# EAGLE design emonPi_v2.0.1 (EAGLE 9.6.2)
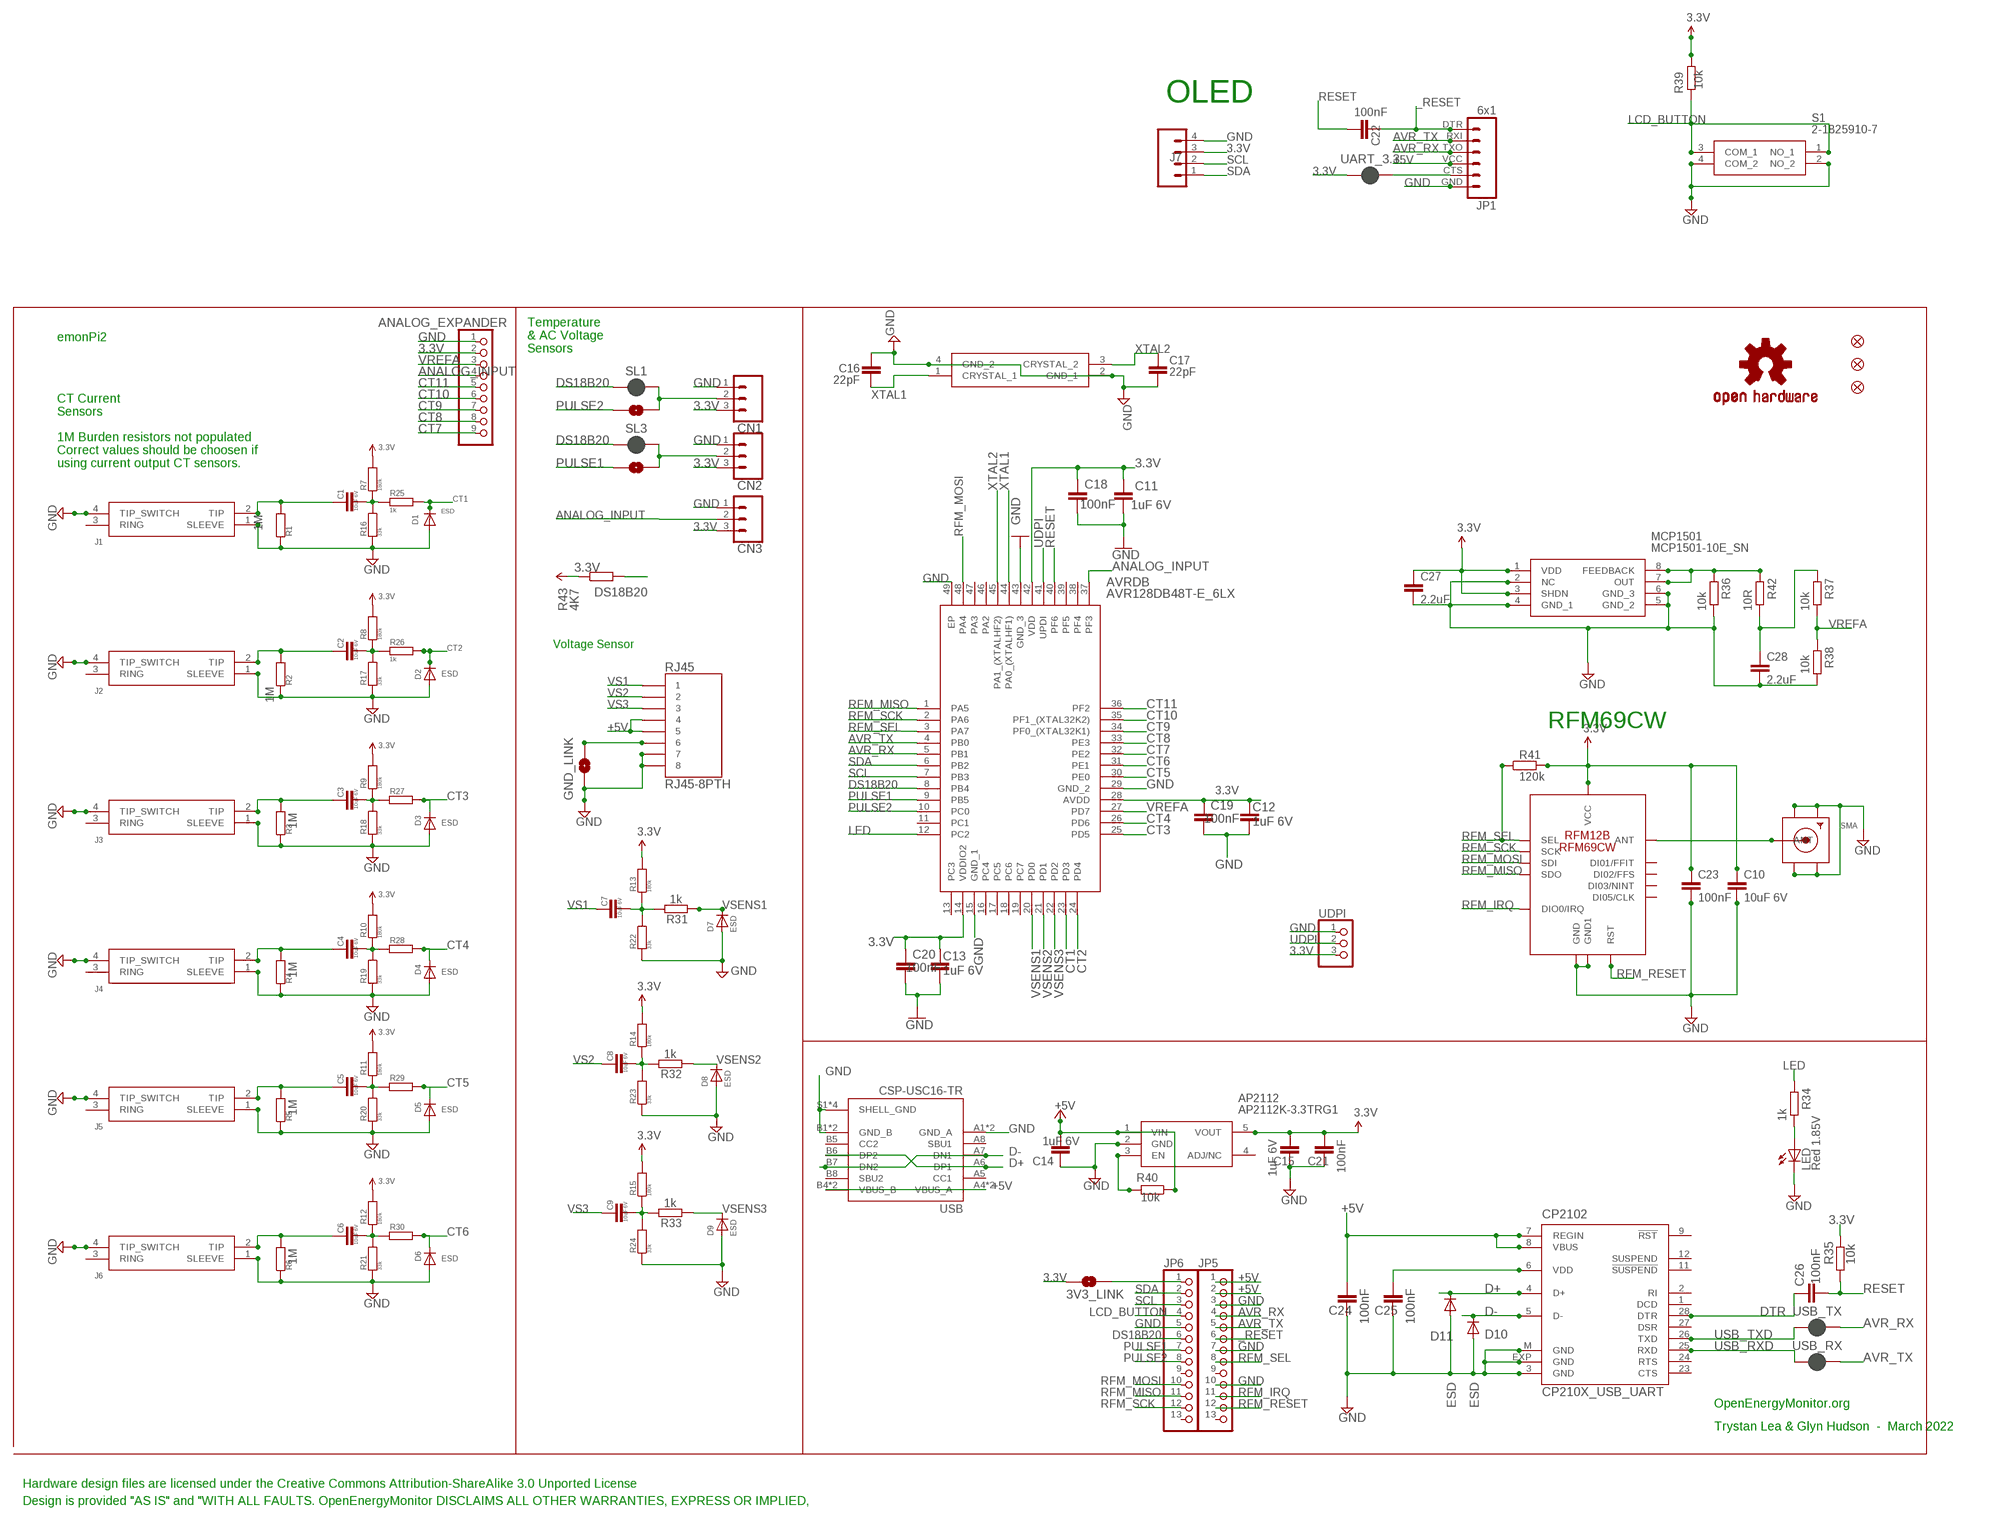
[diagram p0: schematic, sheet 1]

## Parts
3V3_LINK  SOLDERJUMPERNC  [SJ_2S]
ANALOG_EXPANDER  PINHD-1X9  [1X09-BIG]
AP2112  AP2112K-3.3TRG1  [SOT95P282X130-5N]
AVRDB  AVR128DB48T-E_6LX  [QFN40P600X600X90-49N]
C1  10uF 6V  C-EUC0603  [C0603]
C2  10uF 6V  C-EUC0603  [C0603]
C3  10uF 6V  C-EUC0603  [C0603]
C4  10uF 6V  C-EUC0603  [C0603]
C5  10uF 6V  C-EUC0603  [C0603]
C6  10uF 6V  C-EUC0603  [C0603]
C7  10uF 6V  C-EUC0603  [C0603]
C8  10uF 6V  C-EUC0603  [C0603]
C9  10uF 6V  C-EUC0603  [C0603]
C10  10uF 6V  C-EUC0603  [C0603]
C11  1uF 6V  C-EUC0603  [C0603]
C12  1uF 6V  C-EUC0603  [C0603]
C13  1uF 6V  C-EUC0603  [C0603]
C14  1uF 6V  C-EUC0603  [C0603]
C15  1uF 6V  C-EUC0603  [C0603]
C16  22pF  C-EUC0603  [C0603]
C17  22pF  C-EUC0603  [C0603]
C18  100nF  C-EUC0603  [C0603]
C19  100nF  C-EUC0603  [C0603]
C20  100nF  C-EUC0603  [C0603]
C21  100nF  C-EUC0603  [C0603]
C22  100nF  C-EUC0603  [C0603]
C23  100nF  C-EUC0603  [C0603]
C24  100nF  C-EUC0603  [C0603]
C25  100nF  C-EUC0603  [C0603]
C26  100nF  C-EUC0603  [C0603]
C27  2.2uF  C-EUC0603  [C0603]
C28  2.2uF  C-EUC0603  [C0603]
CN1  CONN_03SCREW  [SCREWTERMINAL-3.5MM-3]
CN2  CONN_03SCREW  [SCREWTERMINAL-3.5MM-3]
CN3  CONN_03SCREW  [SCREWTERMINAL-3.5MM-3]
CP2102  CP210X_USB_UART  [MLP28]
D1  ESD  DIODESOD-523  [SOD-523]
D2  ESD  DIODESOD-523  [SOD-523]
D3  ESD  DIODESOD-523  [SOD-523]
D4  ESD  DIODESOD-523  [SOD-523]
D5  ESD  DIODESOD-523  [SOD-523]
D6  ESD  DIODESOD-523  [SOD-523]
D7  ESD  DIODESOD-523  [SOD-523]
D8  ESD  DIODESOD-523  [SOD-523]
D9  ESD  DIODESOD-523  [SOD-523]
D10  ESD  DIODESOD-523  [SOD-523]
D11  ESD  DIODESOD-523  [SOD-523]
FD1  FIDUCIAL1X2  [FIDUCIAL-1X2]
FD2  FIDUCIAL1X2  [FIDUCIAL-1X2]
FD3  FIDUCIAL1X2  [FIDUCIAL-1X2]
GND_LINK  SOLDERJUMPERNC  [SJ_2S]
J1  SJ-3524-SMT-TR  [SJ-3524-SMT-TR]
J2  SJ-3524-SMT-TR  [SJ-3524-SMT-TR]
J3  SJ-3524-SMT-TR  [SJ-3524-SMT-TR]
J4  SJ-3524-SMT-TR  [SJ-3524-SMT-TR]
J5  SJ-3524-SMT-TR  [SJ-3524-SMT-TR]
J6  SJ-3524-SMT-TR  [SJ-3524-SMT-TR]
J7  CONN_04PTH  [1X04]
JP1  6x1  FTDI_BASICPTH  [FTDI_BASIC]
JP5  PINHD-1X13_BIG  [1X13-BIG]
JP6  PINHD-1X13_BIG  [1X13-BIG]
LED  Red 1.85V  LEDCHIP-LED0805  [CHIP-LED0805]
LOGO1  OSHW-LOGOS-COPPER  [OSHW-LOGO-S_COPPER]
MCP1501  MCP1501-10E_SN  [SOIC127P600X175-8N]
R1  1M  R-EU_R1206  [R1206]
R2  1M  R-EU_R1206  [R1206]
R3  1M  R-EU_R1206  [R1206]
R4  1M  R-EU_R1206  [R1206]
R5  1M  R-EU_R1206  [R1206]
R6  1M  R-EU_R1206  [R1206]
R7  180k  R-EU_R0603  [R0603]
R8  180k  R-EU_R0603  [R0603]
R9  180k  R-EU_R0603  [R0603]
R10  180k  R-EU_R0603  [R0603]
R11  180k  R-EU_R0603  [R0603]
R12  180k  R-EU_R0603  [R0603]
R13  180k  R-EU_R0603  [R0603]
R14  180k  R-EU_R0603  [R0603]
R15  180k  R-EU_R0603  [R0603]
R16  33k  R-EU_R0603  [R0603]
R17  33k  R-EU_R0603  [R0603]
R18  33k  R-EU_R0603  [R0603]
R19  33k  R-EU_R0603  [R0603]
R20  33k  R-EU_R0603  [R0603]
R21  33k  R-EU_R0603  [R0603]
R22  33k  R-EU_R0603  [R0603]
R23  33k  R-EU_R0603  [R0603]
R24  33k  R-EU_R0603  [R0603]
R25  1k  R-EU_R0603  [R0603]
R26  1k  R-EU_R0603  [R0603]
R27  1k  R-EU_R0603  [R0603]
R28  1k  R-EU_R0603  [R0603]
R29  1k  R-EU_R0603  [R0603]
R30  1k  R-EU_R0603  [R0603]
R31  1k  R-EU_R0603  [R0603]
R32  1k  R-EU_R0603  [R0603]
R33  1k  R-EU_R0603  [R0603]
R34  1k  R-EU_R0603  [R0603]
R35  10k  R-EU_R0603  [R0603]
R36  10k  R-EU_R0603  [R0603]
R37  10k  R-EU_R0603  [R0603]
R38  10k  R-EU_R0603  [R0603]
R39  10k  R-EU_R0603  [R0603]
R40  10k  R-EU_R0603  [R0603]
R41  120k  R-EU_R0603  [R0603]
R42  10R  R-EU_R0603  [R0603]
R43  4K7  R-EU_R0603  [R0603]
RFM69  RFM12B/69CW  [RFM12B/69CW]
RJ45  RJ45-8PTH  [RJ45-8]
S1  2-1825910-7  [218259107]
SL1  JUMPER-SMT_2_NC_PASTE_NO-SILK  [SMT-JUMPER_2_NC_PASTE_NO-SILK]
SL2  SOLDERJUMPERNC  [SJ_2S]
SL3  JUMPER-SMT_2_NC_PASTE_NO-SILK  [SMT-JUMPER_2_NC_PASTE_NO-SILK]
SL4  SOLDERJUMPERNC  [SJ_2S]
SMA  SMACONNECTOR  [SMA90_DIP]
UART_3.3  JUMPER-SMT_2_NC_PASTE_NO-SILK  [SMT-JUMPER_2_NC_PASTE_NO-SILK]
UDPI  PINHD-1X3  [1X03]
USB  CSP-USC16-TR  [VALCON_CSP-USC16-TR]
USB_RX  JUMPER-SMT_2_NC_PASTE_NO-SILK  [SMT-JUMPER_2_NC_PASTE_NO-SILK]
USB_TX  JUMPER-SMT_2_NC_PASTE_NO-SILK  [SMT-JUMPER_2_NC_PASTE_NO-SILK]
XTAL  MCSJK-7U-12.00-12-10-80-B-10  [MCSJK7U1200121080B10]

## Nets
3.3V: 3V3_LINK.1 ANALOG_EXPANDER.2 AP2112.5(VOUT) AVRDB.14(VDDIO2) AVRDB.28(AVDD) AVRDB.42(VDD) C10.1 C11.1 C12.1 C13.1 C15.2 C18.1 C19.1 C20.1 C21.2 C23.1 C27.1 CN1.3 CN2.3 CN3.3 J7.3 MCP1501.1(VDD) MCP1501.3(SHDN) R7.2 R8.2 R9.2 R10.2 R11.2 R12.2 R13.2 R14.2 R15.2 R35.2 R39.1 R41.2 R43.1 RFM69.VDD(VCC) UART_3.3.1 UDPI.3
+5V [power]: AP2112.1(VIN) C14.2 C24.2 CP2102.7(REGIN) CP2102.8(VBUS) JP1.VCC JP5.1 JP5.2 R40.1 RJ45.4 RJ45.5 USB.A4(VBUS_A) USB.A9(VBUS_A) USB.B4(VBUS_B) USB.B9(VBUS_B)
_RESET: C22.1 JP1.DTR JP5.6
ANALOG_INPUT: ANALOG_EXPANDER.4 AVRDB.37(PF3) CN3.2
AVR_RX: AVRDB.5(PB1) JP1.TXO JP5.4 USB_TX.2
AVR_TX: AVRDB.4(PB0) JP1.RXI JP5.5 USB_RX.2
CT1: AVRDB.23(PD3) D1.K(C) R25.2
CT2: AVRDB.24(PD4) D2.K(C) R26.2
CT3: AVRDB.25(PD5) D3.K(C) R27.1
CT4: AVRDB.26(PD6) D4.K(C) R28.1
CT5: AVRDB.30(PE0) D5.K(C) R29.1
CT6: AVRDB.31(PE1) D6.K(C) R30.1
CT7: ANALOG_EXPANDER.9 AVRDB.32(PE2)
CT8: ANALOG_EXPANDER.8 AVRDB.33(PE3)
CT9: ANALOG_EXPANDER.7 AVRDB.34(PF0_(XTAL32K1))
CT10: ANALOG_EXPANDER.6 AVRDB.35(PF1_(XTAL32K2))
CT11: ANALOG_EXPANDER.5 AVRDB.36(PF2)
D+: CP2102.4(D+) D11.K(C) USB.A6(DP1) USB.B6(DP2)
D-: CP2102.5(D-) D10.K(C) USB.A7(DN1) USB.B7(DN2)
DIG1: RFM69.ANT SMA.ANTENNA(ANT)
DS18B20: AVRDB.8(PB4) JP6.6 R43.2 SL1.1 SL3.1
DTR: C26.1 CP2102.28(DTR)
GND [gnd]: ANALOG_EXPANDER.1 AP2112.2(GND) AVRDB.15(GND_1) AVRDB.29(GND_2) AVRDB.43(GND_3) AVRDB.49(EP) C10.2 C11.2 C12.2 C13.2 C14.1 C15.1 C16.1 C17.2 C18.2 C19.2 C20.2 C21.1 C23.2 C24.1 C25.1 C27.2 C28.2 CN1.1 CN2.1 CN3.1 CP2102.3(GND) CP2102.EXP(GND) CP2102.M(GND) D1.A D2.A D3.A D4.A D5.A D6.A D7.A D8.A D9.A D10.A D11.A GND_LINK.1 J1.1(SLEEVE) J1.4(TIP_SWITCH) J2.1(SLEEVE) J2.4(TIP_SWITCH) J3.1(SLEEVE) J3.4(TIP_SWITCH) J4.1(SLEEVE) J4.4(TIP_SWITCH) J5.1(SLEEVE) J5.4(TIP_SWITCH) J6.1(SLEEVE) J6.4(TIP_SWITCH) J7.4 JP1.GND JP5.3 JP5.7 JP5.10 JP6.5 LED.C MCP1501.2(NC) MCP1501.4(GND_1) MCP1501.5(GND_2) MCP1501.6(GND_3) R1.1 R2.1 R3.1 R4.1 R5.1 R6.1 R16.2 R17.2 R18.2 R19.2 R20.2 R21.2 R22.2 R23.1 R24.1 R36.1 R38.1 RFM69.GND RFM69.GND1 RJ45.7 RJ45.8 S1.2(NO_2) S1.4(COM_2) SMA.GND1 SMA.GND2 SMA.GND3 SMA.GND4 UDPI.1 USB.A1(GND_A) USB.A12(GND_A) USB.B1(GND_B) USB.B12(GND_B) USB.S1(SHELL_GND) USB.S2(SHELL_GND) USB.S3(SHELL_GND) USB.S4(SHELL_GND) XTAL.2(GND_1) XTAL.4(GND_2)
LCD_BUTTON: JP6.4 R39.2 S1.1(NO_1) S1.3(COM_1)
LED: AVRDB.12(PC2) R34.2
N$1: C1.1 J1.2(TIP) R1.2
N$2: C7.2 R13.1 R22.1 R31.2
N$3: C3.1 J3.2(TIP) R3.2
N$4: C8.2 R14.1 R23.2 R32.2
N$5: C4.1 J4.2(TIP) R4.2
N$12: C9.2 R15.1 R24.2 R33.2
N$13: C2.1 J2.2(TIP) R2.2
N$14: C5.1 J5.2(TIP) R5.2
N$15: C5.2 R11.1 R20.1 R29.2
N$16: C2.2 R8.1 R17.1 R26.1
N$17: C4.2 R10.1 R19.1 R28.2
N$18: C1.2 R7.1 R16.1 R25.1
N$19: C6.1 J6.2(TIP) R6.2
N$20: C6.2 R12.1 R21.1 R30.2
N$21: C3.2 R9.1 R18.1 R27.2
N$22: CN1.2 SL1.2 SL2.2
N$23: CN2.2 SL3.2 SL4.2
N$24: GND_LINK.2 RJ45.6
N$25: AP2112.3(EN) R40.2
N$26: C28.1 R37.2 R42.1
N$27: MCP1501.7(OUT) MCP1501.8(FEEDBACK) R36.2 R42.2
N$28: 3V3_LINK.2 JP6.1
N$31: C25.2 CP2102.6(VDD)
N$33: JP1.CTS UART_3.3.2
N$41: LED.A R34.1
PULSE1: AVRDB.9(PB5) JP6.7 SL4.1
PULSE2: AVRDB.10(PC0) JP6.8 SL2.1
RESET: AVRDB.40(PF6) C22.2 C26.2 R35.1
RFM_IRQ: JP5.11 RFM69.IRQ(DIO0/IRQ)
RFM_MISO: AVRDB.1(PA5) JP6.11 RFM69.SDO
RFM_MOSI: AVRDB.48(PA4) JP6.10 RFM69.SDI
RFM_RESET: JP5.12 RFM69.RST
RFM_SCK: AVRDB.2(PA6) JP6.12 RFM69.SCK
RFM_SEL: AVRDB.3(PA7) JP5.8 R41.1 RFM69.SEL
SCL: AVRDB.7(PB3) J7.2 JP6.3
SDA: AVRDB.6(PB2) J7.1 JP6.2
UDPI: AVRDB.41(UPDI) UDPI.2
USB_RXD: CP2102.25(RXD) USB_RX.1
USB_TXD: CP2102.26(TXD) USB_TX.1
VREFA: ANALOG_EXPANDER.3 AVRDB.27(PD7) R37.1 R38.2
VS1: C7.1 RJ45.1
VS2: C8.1 RJ45.2
VS3: C9.1 RJ45.3
VSENS1: AVRDB.20(PD0) D7.K(C) R31.1
VSENS2: AVRDB.21(PD1) D8.K(C) R32.1
VSENS3: AVRDB.22(PD2) D9.K(C) R33.1
XTAL1: AVRDB.44(PA0_(XTALHF1)) C16.2 XTAL.1(CRYSTAL_1)
XTAL2: AVRDB.45(PA1_(XTALHF2)) C17.1 XTAL.3(CRYSTAL_2)
Unconnected: AP2112.4(ADJ/NC) AVRDB.11(PC1) AVRDB.13(PC3) AVRDB.16(PC4) AVRDB.17(PC5) AVRDB.18(PC6) AVRDB.19(PC7) AVRDB.38(PF4) AVRDB.39(PF5) AVRDB.46(PA2) AVRDB.47(PA3) CP2102.1(DCD) CP2102.2(RI) CP2102.9(!RST) CP2102.11(!SUSPEND) CP2102.12(SUSPEND) CP2102.23(CTS) CP2102.24(RTS) CP2102.27(DSR) J1.3(RING) J2.3(RING) J3.3(RING) J4.3(RING) J5.3(RING) J6.3(RING) JP5.9 JP5.13 JP6.9 JP6.13 RFM69.CLK(DI05/CLK) RFM69.FFIT(DI01/FFIT) RFM69.FFS(DI02/FFS) RFM69.NINT(DI03/NINT) USB.A5(CC1) USB.A8(SBU1) USB.B5(CC2) USB.B8(SBU2)

## Notes on the sheet
- OLED
- emonPi2
- Temperature 
  & AC Voltage
  Sensors
- CT Current 
  Sensors
- 1M Burden resistors not populated
  Correct values should be choosen if 
  using current output CT sensors.
- Voltage Sensor
- RFM69CW
- OpenEnergyMonitor.org
- Trystan Lea & Glyn Hudson  -  March 2022
- Hardware design files are licensed under the Creative Commons Attribution-ShareAlike 3.0 Unported License
- Design is provided "AS IS" and "WITH ALL FAULTS. OpenEnergyMonitor DISCLAIMS ALL OTHER WARRANTIES, EXPRESS OR IMPLIED,

## Library data of the parts
3V3_LINK GND_LINK SL2 SL4 = SparkFun:SOLDERJUMPER: Solder Jumper Standard SMD solder jumper. Used to automate production. Two varients : Normally Open and Normally Closed are the same, but have different paste layers. NC will have a large amount of paste and should jumper during reflow.
ANALOG_EXPANDER = adafruit:PINHD-1X9: Pin header 1x10 0.1" spacing With round pins
AP2112 = AP2112K-3.3TRG1:AP2112K-3.3TRG1: 600mA 3.3V LDO Regulator Enable SOT23-5 DiodesZetex AP2112K-3.3TRG1, LDO Voltage Regulator, 3.3 V +/-1.5%, 2.5 6 Vin, 5-Pin SOT-23 Source: Datasheet <http://uk.rs-online.com/web/p/products/8283509>; ARROW_PART_NUMBER: AP2112K-3.3TRG1; ARROW_PRICE-STOCK: https://www.arrow.com/en/products/ap2112k-3.3trg1/diodes-incorporated?region=nac; DESCRIPTION: 600mA 3.3V LDO Regulator Enable SOT23-5 DiodesZetex AP2112K-3.3TRG1, LDO Voltage Regulator, 3.3 V +/-1.5%, 2.5 6 Vin, 5-Pin SOT-23; HEIGHT: 1.3mm; MANUFACTURER_NAME: Diodes Inc.; MANUFACTURER_PART_NUMBER: AP2112K-3.3TRG1; MOUSER_PART_NUMBER: 621-AP2112K-3.3TRG1; MOUSER_PRICE-STOCK: https://www.mouser.co.uk/ProductDetail/Diodes-Incorporated/AP2112K-33TRG1?qs=x6A8l6qLYDDPYHosCdzh%2FA%3D%3D
AVRDB = AVR128DB48T-E_6LX:AVR128DB48T-E_6LX: IC MCU 8BIT 128KB FLASH 48VQFN Source: Datasheet <https://4donline.ihs.com/images/VipMasterIC/IC/MCHP/MCHP-S-A0010410415/MCHP-S-A0011111973-1.pdf?hkey=6D3A4C79FDBF58556ACFDE234799DDF0>; DESCRIPTION: IC MCU 8BIT 128KB FLASH 48VQFN; HEIGHT: 0.9mm; MANUFACTURER_NAME: Microchip; MANUFACTURER_PART_NUMBER: AVR128DB48T-E/6LX; MOUSER_PART_NUMBER: 579-VR128DB48T-E/6LX; MOUSER_PRICE-STOCK: https://www.mouser.co.uk/ProductDetail/Microchip-Technology/AVR128DB48T-E-6LX?qs=vmHwEFxEFR%252BvecSHjxOfmQ%3D%3D
C1-C9 C11-C16 C18-C22 C24 C25 = resistor:C-EU: CAPACITOR, European symbol
C10 C23 C26-C28 = rcl:C-EU: CAPACITOR, European symbol
C17 = resistor:C-EU: CAPACITOR, European symbol; SPICEPREFIX: C
CN1-CN3 = SparkFun-Connectors:CONN_03: Multi connection point. Often used as Generic Header-pin footprint for 0.1 inch spaced/style header connections On any of the 0.1 inch spaced packages, you can populate with these: Break Away Headers - Straight <https://www.sparkfun.com/products/116> (PRT-00116) Break Away Male Headers - Right Angle <https://www.sparkfun.com/products/553> (PRT-00553) Female Headers <https://www.sparkfun.com/products/115> (PRT-00115) Break Away Headers - Machine Pin <https://www.sparkfun.com/products/117> (PRT-00117) Break Away Female Headers - Swiss Machine Pin <https://www.sparkfun.com/products/743> (PRT-00743) Stackable Header - 3 Pin (Female, 0.1") <https://www.sparkfun.com/products/13875> (PRT-13875) For SCREWTERMINALS and SPRING TERMINALS visit here: Screw Terimnals on SparkFun.com <https://www.sparkfun.com/search/results?term=Screw+Terminals> (5mm/3.5mm/2.54mm spacing) This device is also useful as a general connection point to wire up your design to another part of your project. Our various solder wires solder well into these plated through hole pads. Hook-Up Wire - Assortment (Stranded, 22 AWG) <https://www.sparkfun.com/products/11375> (PRT-11375) Hook-Up Wire - Assortment (Solid Core, 22 AWG) <https://www.sparkfun.com/products/11367> (PRT-11367) View the entire wire category on our website here <https://www.sparkfun.com/categories/141> Special notes: Molex polarized connector foot print use with SKU : PRT-08232 with associated crimp pins and housings.; PROD_ID: CONN-08288; SF_ID: PRT-08235
CP2102 = SparkFun-DigitalIC:CP210X_USB_UART: Single-Chip USB to UART Bridge Source: www.silabs.com .. CP2101.pdf / cp2102.pdf. Spark Fun Electronics SKU : COM-00310
D1-D11 = microbuilder:DIODE: Diode SMA Model Volts Amps Type Vf Vr Digikey # Notes SSA34-E3 40V 3A Schottky 480mV @ 3A 200uA @ 40V SSA34-E3/61TGITR-ND CDBA120-G 20V 1A Schottky 500mV @ 1A 500uA @ 20V 641-1014-6-ND REEL MBRA210 10V 2A Schottky 350mV @ 2A 700uA @ 10V MBRA210LT3 SOD-123 Model Volts Amps Type Vf Vr Order # Notes BAT54T1G 30V 200mA Schottky 800mV @ 200mA 2uA @ 25V BAT54T1GOSTR-ND B0530W 30V 500mA Schottky 430mV @ 500mA 130uA @ 30V B0530W-FDICT-ND REEL MBR120 1A 20V Schottky 340mV @ 1A MBR120VLSFT1GOSCT-ND SOD-323 Model Volts Amps Type Vf Vr Order # Notes PMEG2005EJ 20V 500mA Schottky 355mV @ 500mA 568-4110-1-ND ZLLS410 10V 570mA Schottky 380mV @ 570mA ZLLS410CT-ND 1N4148WS 75V 150mA Silicon/Simple 1V 1N4148WSFSCT-ND REEL SOD-523 Model Volts Amps Type Vf Vr Order # Notes BAT54XV2 30V 200mA Schottky 0.8V @ 100mA BAT54XV2CT-ND TB751S 30V 30mA Schottky RB751S-40TE61CT-ND SOT23-R/W (R = Solder Paste/Reflow Ovens, W = Hand-Soldering) Model Volts Amps Type Vf Vr Order # Notes BAT54FILM 40V 300mA Schottky 497-7162-1-ND
FD1-FD3 = SparkFun-Aesthetics:FIDUCIAL: Fiducial Alignment Points Point-of-reference for pick-and-place machines and other optical instruments.
J1-J6 = SJ-3524-SMT-TR:SJ-3524-SMT-TR: Phone Connectors Audio Jacks Source: Datasheet <https://datasheet.datasheetarchive.com/originals/distributors/Datasheets-DGA1/151896.pdf>; ARROW_PART_NUMBER: SJ-3524-SMT-TR; ARROW_PRICE-STOCK: https://www.arrow.com/en/products/sj-3524-smt-tr/cui-devices?region=nac; DESCRIPTION: Phone Connectors Audio Jacks; HEIGHT: mm; MANUFACTURER_NAME: CUI Inc.; MANUFACTURER_PART_NUMBER: SJ-3524-SMT-TR; MOUSER_PART_NUMBER: 490-SJ-3524-SMT-TR; MOUSER_PRICE-STOCK: https://www.mouser.co.uk/ProductDetail/CUI-Devices/SJ-3524-SMT-TR?qs=WyjlAZoYn50%252B7OcNbxvx%252BA%3D%3D
J7 = SparkFun-Connectors:CONN_04: Multi connection point. Often used as Generic Header-pin footprint for 0.1 inch spaced/style header connections On any of the 0.1 inch spaced packages, you can populate with these: Break Away Headers - Straight <https://www.sparkfun.com/products/116> (PRT-00116) Break Away Male Headers - Right Angle <https://www.sparkfun.com/products/553> (PRT-00553) Female Headers <https://www.sparkfun.com/products/115> (PRT-00115) Break Away Headers - Machine Pin <https://www.sparkfun.com/products/117> (PRT-00117) Break Away Female Headers - Swiss Machine Pin <https://www.sparkfun.com/products/743> (PRT-00743) For SCREWTERMINALS and SPRING TERMINALS visit here: Screw Terimnals on SparkFun.com <https://www.sparkfun.com/search/results?term=Screw+Terminals> (5mm/3.5mm/2.54mm spacing) This device is also useful as a general connection point to wire up your design to another part of your project. Our various solder wires solder well into these plated through hole pads. Hook-Up Wire - Assortment (Stranded, 22 AWG) <https://www.sparkfun.com/products/11375> (PRT-11375) Hook-Up Wire - Assortment (Solid Core, 22 AWG) <https://www.sparkfun.com/products/11367> (PRT-11367) View the entire wire category on our website here <https://www.sparkfun.com/categories/141> Special notes: Molex polarized connector foot print use with SKU : PRT-08231 with associated crimp pins and housings. 1MM SMD Version SKU: PRT-10208; PROD_ID: CONN-09696
JP1 = SparkFun:FTDI_BASIC: FTDI Basic: 3.3V and 5V
JP5 JP6 = adafruit:PINHD-1X13: PIN HEADER
LED = adafruit:LED: LED OSRAM: - CHIPLED LG R971, LG N971, LY N971, LG Q971, LY Q971, LO R971, LY R971 LH N974, LH R974 LS Q976, LO Q976, LY Q976 LO Q996 - Hyper CHIPLED LW Q18S LB Q993, LB Q99A, LB R99A - SideLED LS A670, LO A670, LY A670, LG A670, LP A670 LB A673, LV A673, LT A673, LW A673 LH A674 LY A675 LS A676, LA A676, LO A676, LY A676, LW A676 LS A679, LY A679, LG A679 - Hyper Micro SIDELED® LS Y876, LA Y876, LO Y876, LY Y876 LT Y87S - SmartLED LW L88C, LW L88S LB L89C, LB L89S, LG L890 LS L89K, LO L89K, LY L89K LS L896, LA L896, LO L896, LY L896 - TOPLED LS T670, LO T670, LY T670, LG T670, LP T670 LSG T670, LSP T670, LSY T670, LOP T670, LYG T670 LG T671, LOG T671, LSG T671 LB T673, LV T673, LT T673, LW T673 LH T674 LS T676, LA T676, LO T676, LY T676, LB T676, LH T676, LSB T676, LW T676 LB T67C, LV T67C, LT T67C, LS T67K, LO T67K, LY T67K, LW E67C LS E67B, LA E67B, LO E67B, LY E67B, LB E67C, LV E67C, LT E67C LW T67C LS T679, LY T679, LG T679 LS T770, LO T770, LY T770, LG T770, LP T770 LB T773, LV T773, LT T773, LW T773 LH T774 LS E675, LA E675, LY E675, LS T675 LS T776, LA T776, LO T776, LY T776, LB T776 LHGB T686 LT T68C, LB T68C - Hyper Mini TOPLED® LB M676 - Mini TOPLED Santana® LG M470 LS M47K, LO M47K, LY M47K Source: http://www.osram.convergy.de/
LOGO1 = SparkFun-Aesthetics:OSHW-LOGO: Open-Source Hardware (OSHW) Logo This logo indicates the piece of hardware it is found on incorporates a OSHW license and/or adheres to the definition of open source hardware found here: http://freedomdefined.org/OSHW
MCP1501 = MCP1501-10E_SN:MCP1501-10E_SN: MICROCHIP - MCP1501-10E/SN - VOLTAGE REF, SERIES, 1.024V, NSOIC-8 Source: Datasheet <http://www.farnell.com/datasheets/2015662.pdf>; ARROW_PART_NUMBER: MCP1501-10E/SN; ARROW_PRICE-STOCK: https://www.arrow.com/en/products/mcp1501-10esn/microchip-technology; DESCRIPTION: MICROCHIP - MCP1501-10E/SN - VOLTAGE REF, SERIES, 1.024V, NSOIC-8; HEIGHT: 1.75mm; MANUFACTURER_NAME: Microchip; MANUFACTURER_PART_NUMBER: MCP1501-10E/SN; MOUSER_PART_NUMBER: 579-MCP1501-10E/SN; MOUSER_PRICE-STOCK: https://www.mouser.co.uk/ProductDetail/Microchip-Technology/MCP1501-10E-SN?qs=BA62vJVifGrukY%252BvRXgfwQ%3D%3D
R1-R43 = rcl:R-EU_: RESISTOR, European symbol
RFM69 = eagle_jeelabs:RFM12B/69CW
RJ45 = SparkFun-Connectors:RJ45-8: RJ45 Jack Simple RJ45, 8-pin connection - connector for common Cat5, Cat5e, and Cat6 Ethernet cables. Footprint not yet proven in production. Connector sku is PRT-00643; Breakout PCB sku is BOB-00716.
S1 = 2-1825910-7:2-1825910-7: Relays, Contactors & Switches Switches Tactile Switches FSM14JH=6MM TACT SWITCH, HIGH TEMP Source: Datasheet <http://www.te.com/commerce/DocumentDelivery/DDEController?Action=showdoc&DocId=Customer Drawing1825910C10pdfEnglishENG_CD_1825910_C10.pdf2-1825910-7>; ARROW_PART_NUMBER: 2-1825910-7; ARROW_PRICE-STOCK: https://www.arrow.com/en/products/2-1825910-7/te-connectivity?region=europe; DESCRIPTION: Relays, Contactors & Switches Switches Tactile Switches FSM14JH=6MM TACT SWITCH, HIGH TEMP; HEIGHT: 13mm; MANUFACTURER_NAME: TE Connectivity; MANUFACTURER_PART_NUMBER: 2-1825910-7; MOUSER_PART_NUMBER: 506-2-1825910-7; MOUSER_PRICE-STOCK: https://www.mouser.co.uk/ProductDetail/TE-Connectivity-PB/2-1825910-7?qs=epcAG6di8szpGFLvuwXKeQ%3D%3D
SL1 SL3 UART_3.3 USB_RX USB_TX = SparkFun-Jumpers:JUMPER-SMT_2_NC_PASTE: Normally closed solder jumper This jumper has an aperture in the stencil to allow solder paste to bridge the split in the wire so it's normally closed (NC). Wick off the solder to open the connection. Reapply solder to reclose the connection.
SMA = adafruit:SMACONNECTOR: SMA Connector 90° DIP SMA Connector, 50 Ohm (4UConnector: 07259)
UDPI = adafruit:PINHD-1X3: PIN HEADER
USB = CSP-USC16-TR:CSP-USC16-TR: Check availability <https://pricing.snapeda.com/parts/CSP-USC16-TR/Valcon/view-part?ref=eda>; AVAILABILITY: In Stock; DESCRIPTION: CSP-USC16-TR Valcon USB Type C Surface Mount PCB Socket; MF: Valcon; MP: CSP-USC16-TR; PACKAGE: None; PRICE: None; PURCHASE-URL: https://pricing.snapeda.com/search/part/CSP-USC16-TR/?ref=eda
XTAL = MCSJK-7U-12.00-12-10-80-B-10:MCSJK-7U-12.00-12-10-80-B-10: CRYSTAL, 12MHZ, 12PF, 3.2MM X 2.5MM Source: Datasheet <https://componentsearchengine.com/Datasheets/2/MCSJK-7U-12.00-12-10-80-B-10.pdf>; DESCRIPTION: CRYSTAL, 12MHZ, 12PF, 3.2MM X 2.5MM; HEIGHT: 0.8mm; MANUFACTURER_NAME: MULTICOMP; MANUFACTURER_PART_NUMBER: MCSJK-7U-12.00-12-10-80-B-10

## Net classes
0 default: width 0.203 mm, drill 0.6 mm, clearance 0.203 mm
1 power: width 0.305 mm, drill 0.6 mm, clearance 0.254 mm
2 gnd: width 0.254 mm, drill 0.6 mm, clearance 0.254 mm
3 5V0_PI: width 0.406 mm, drill 0.4 mm
4 3V3_PI: width 0.254 mm, drill 0.4 mm

## Board
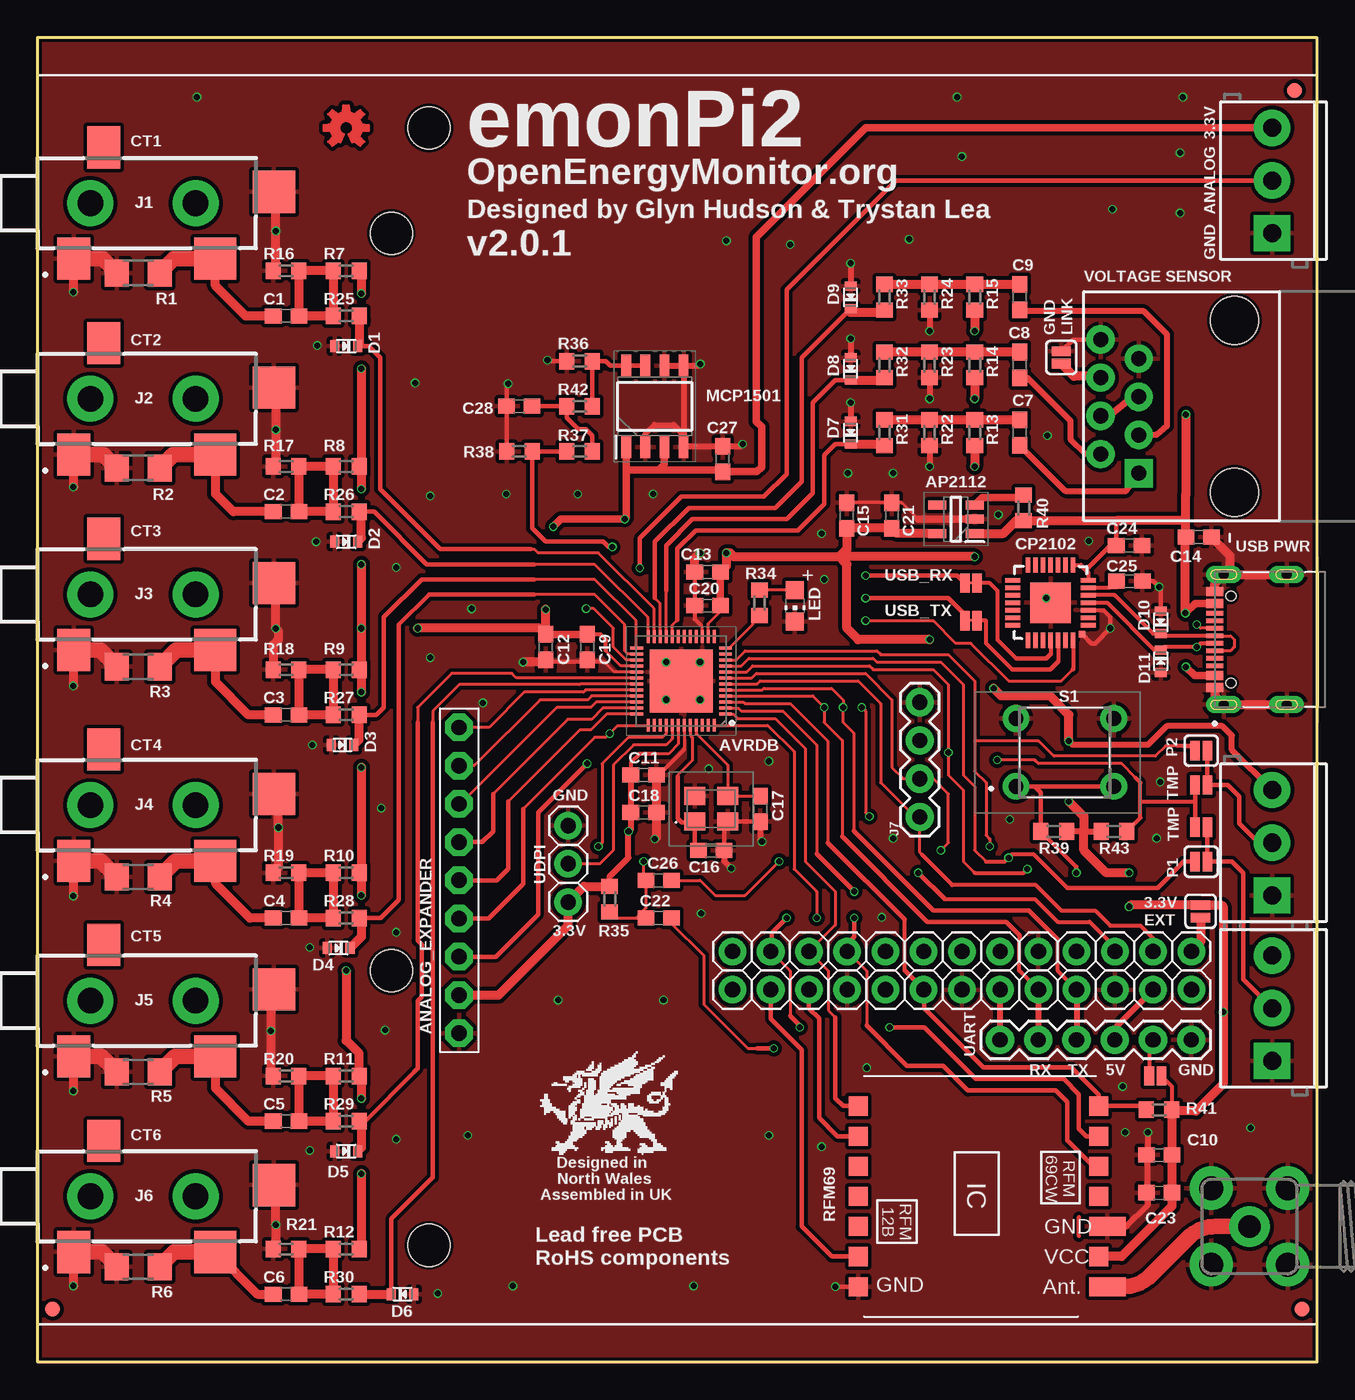
[diagram p1: board, top side]
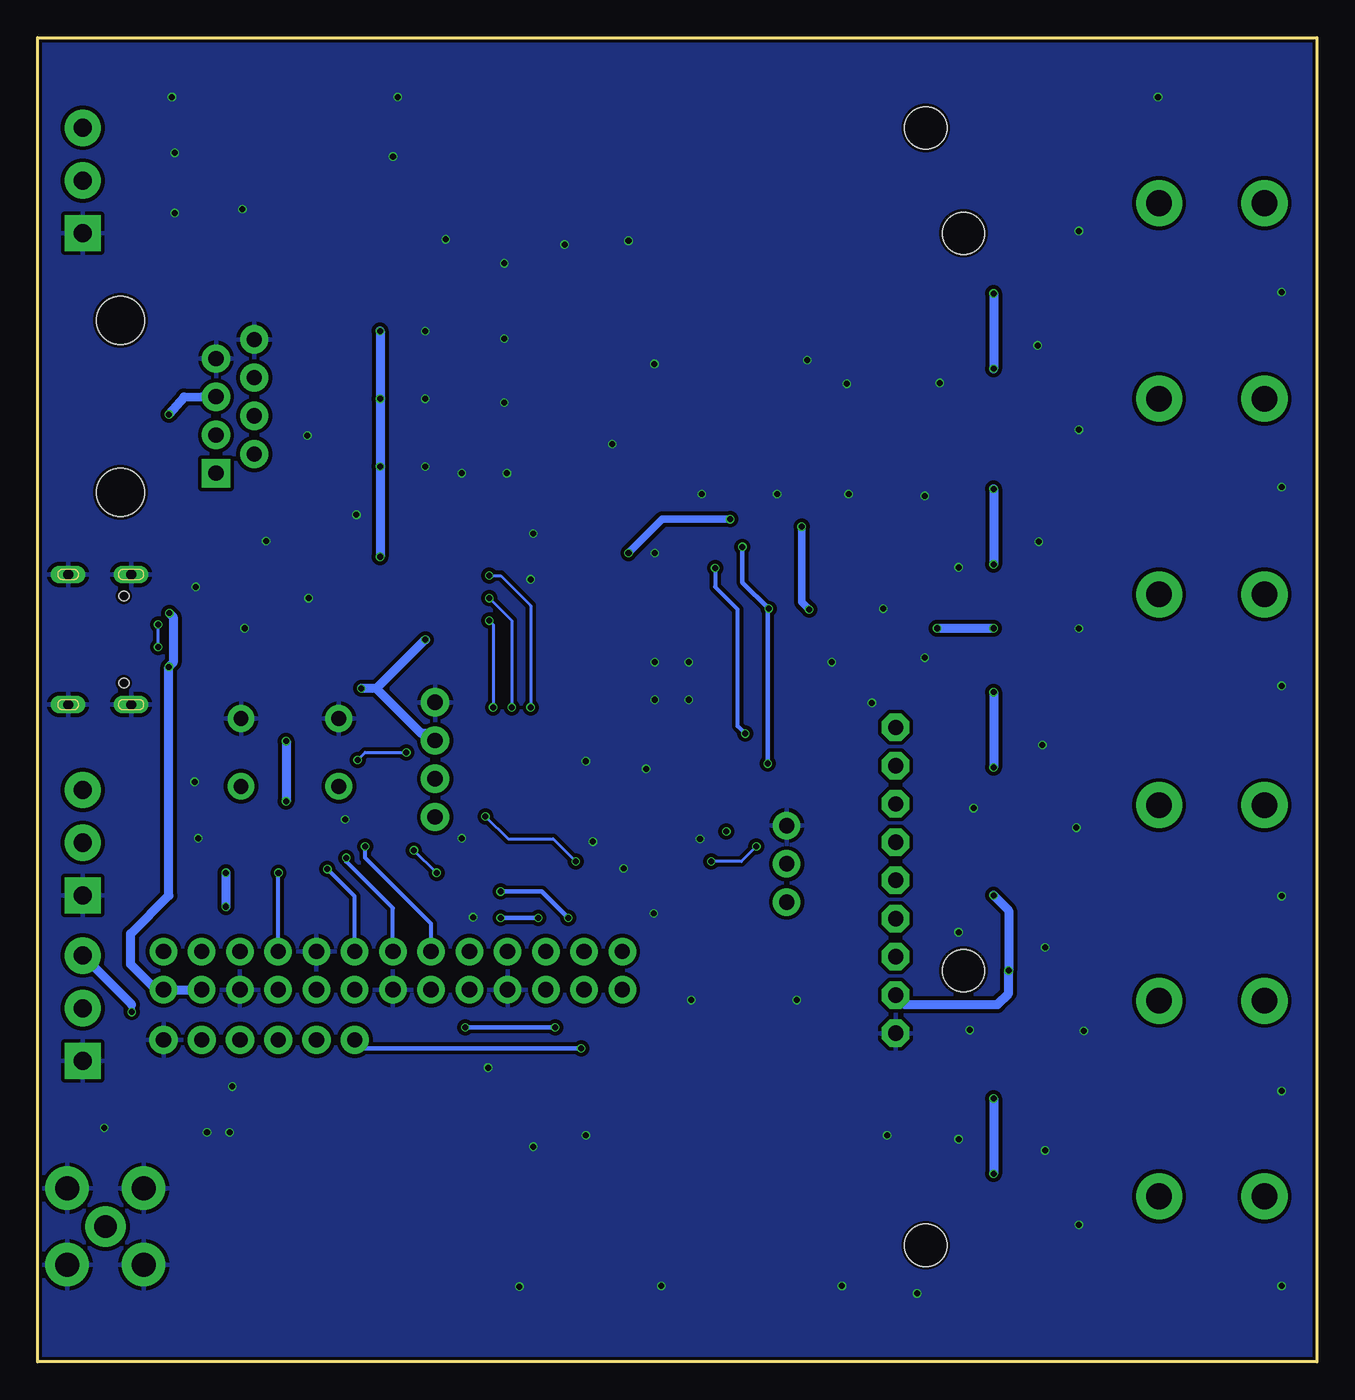
[diagram p2: board, bottom side, seen from below]

Size 85 x 88 mm. Coordinates in mm from the lower left corner, seen from the top.
Outline: 0,0 85,0 85,88 0,88 0,0
Copper layers (1*16): Top 0.035mm / dielectric 1.6mm / Bottom 0.035mm
Design rules "jlcpcb-2layers": minimum track width 5mil, minimum drill 0.3mm, track to track 5mil, track to pad 5mil, pad to pad 5mil, via to via 5mil, smd to smd 5mil, copper to edge 0.2mm, drill to drill 6mil, minimum pad ring 10mil, minimum via ring 3mil, stop-mask expansion 4mil, vias tented up to drill 0mil, thermal gap 10mil
Holes 2.8 mm at 23.5,26 23.5,75 26,7.75 26,82

### Footprints (pad centres in the part's own frame; a part is rotated, then mirrored left to right if it is on the bottom)
SJ_2S = smd 0.635 x 1.27: 1 -0.412,0; 2 0.412,0
1X09-BIG = drill 1.016 pad 1.778 octagon: 1 -10.16,0; 2 -7.62,0; 3 -5.08,0; 4 -2.54,0; 5 0,0; 6 2.54,0; 7 5.08,0; 8 7.62,0; 9 10.16,0
SOT95P282X130-5N = smd 1.2 x 0.6: 1 -1.25,0.95; 2 -1.25,0; 3 -1.25,-0.95; 4 1.25,-0.95; 5 1.25,0.95
QFN40P600X600X90-49N = smd 0.85 x 0.2: 1 -2.95,2.2; 2 -2.95,1.8; 3 -2.95,1.4; 4 -2.95,1; 5 -2.95,0.6; 6 -2.95,0.2; 7 -2.95,-0.2; 8 -2.95,-0.6; 9 -2.95,-1; 10 -2.95,-1.4; 11 -2.95,-1.8; 12 -2.95,-2.2; 25 2.95,-2.2; 26 2.95,-1.8; 27 2.95,-1.4; 28 2.95,-1; 29 2.95,-0.6; 30 2.95,-0.2; 31 2.95,0.2; 32 2.95,0.6; 33 2.95,1; 34 2.95,1.4; 35 2.95,1.8; 36 2.95,2.2 | smd 0.2 x 0.85: 13 -2.2,-2.95; 14 -1.8,-2.95; 15 -1.4,-2.95; 16 -1,-2.95; 17 -0.6,-2.95; 18 -0.2,-2.95; 19 0.2,-2.95; 20 0.6,-2.95; 21 1,-2.95; 22 1.4,-2.95; 23 1.8,-2.95; 24 2.2,-2.95; 37 2.2,2.95; 38 1.8,2.95; 39 1.4,2.95; 40 1,2.95; 41 0.6,2.95; 42 0.2,2.95; 43 -0.2,2.95; 44 -0.6,2.95; 45 -1,2.95; 46 -1.4,2.95; 47 -1.8,2.95; 48 -2.2,2.95 | smd 4.2 x 4.2: 49 0,0
C0603 = smd 1.1 x 1: 1 -0.85,0; 2 0.85,0
SCREWTERMINAL-3.5MM-3 = drill 1.2 pad 2.413 square: 1 0,0 | drill 1.2 pad 2.413: 2 3.5,0; 3 7,0
MLP28 = smd 1 x 0.3: 1 -2.5,1.5; 2 -2.5,1; 3 -2.5,0.5; 4 -2.5,0; 5 -2.5,-0.5; 6 -2.5,-1; 7 -2.5,-1.5; 15 2.5,-1.5; 16 2.5,-1; 17 2.5,-0.5; 18 2.5,0; 19 2.5,0.5; 20 2.5,1; 21 2.5,1.5 | smd 0.3 x 1: 8 -1.5,-2.5; 9 -1,-2.5; 10 -0.5,-2.5; 11 0,-2.5; 12 0.5,-2.5; 13 1,-2.5; 14 1.5,-2.5; 22 1.5,2.5; 23 1,2.5; 24 0.5,2.5; 25 0,2.5; 26 -0.5,2.5; 27 -1,2.5; 28 -1.5,2.5 | smd 2.7 x 2.7: EXP 0,0 | smd 0.435 x 0.435: M -2.103,2.103
SOD-523 = smd 0.8 x 0.6: A 0,-0.75; K 0,0.75
FIDUCIAL-1X2 = smd 1 x 1: 1 0,0
SJ-3524-SMT-TR = smd 2.2 x 2.8: 1 2.4,-6.7; 3 4.4,0.7 | smd 2.8 x 2.8: 2 11.8,-6.7; 4 15.7,-2.25 | drill 1.7 pad 2.55: 5 3.5,-3; 6 10.5,-3
1X04 = drill 1.016 pad 1.88: 1 0,0; 2 2.54,0; 3 5.08,0; 4 7.62,0
FTDI_BASIC = drill 1.016 pad 1.88: CTS 10.16,0; DTR 0,0; GND 12.7,0; RXI 2.54,0; TXO 5.08,0; VCC 7.62,0
1X13-BIG = drill 1.016 pad 1.676: 1 -15.24,0; 2 -12.7,0; 3 -10.16,0; 4 -7.62,0; 5 -5.08,0; 6 -2.54,0; 7 0,0; 8 2.54,0; 9 5.08,0; 10 7.62,0; 11 10.16,0; 12 12.7,0; 13 15.24,0
CHIP-LED0805 = smd 1.2 x 1.2: A 0,-1.05; C 0,1.05
SOIC127P600X175-8N = smd 1.5 x 0.65: 1 -2.7,1.905; 2 -2.7,0.635; 3 -2.7,-0.635; 4 -2.7,-1.905; 5 2.7,-1.905; 6 2.7,-0.635; 7 2.7,0.635; 8 2.7,1.905
R1206 = smd 1.6 x 1.803: 1 -1.422,0; 2 1.422,0
R0603 = smd 1 x 1.1: 1 -0.85,0; 2 0.85,0
RFM12B/69CW = smd 2.413 x 1.27: ANT 9.06,-6; GND 9.06,-2 | smd 1.27 x 1.27: CLK -7.5,-2; FFIT -7.5,0; FFS -7.5,2; GND1 -7.5,-6; IRQ -7.5,4; NINT 8.5,0; RST -7.5,-4; SCK 8.5,4; SDI 8.5,2; SDO -7.5,6; SEL 8.5,6; VDD 8.5,-4
RJ45-8 = drill 1 pad 1.88 square: 1 -4.445,6.35 | drill 1 pad 1.88: 2 -3.175,8.89; 3 -1.905,6.35; 4 -0.635,8.89; 5 0.635,6.35; 6 1.905,8.89; 7 3.175,6.35; 8 4.445,8.89 | hole 3.2: -5.715,0; 5.715,0
218259107 = drill 0.99 pad 1.54: 1 2.76,2.25; 2 2.76,-2.25; 3 -3.74,2.25; 4 -3.74,-2.25
SMT-JUMPER_2_NC_PASTE_NO-SILK = smd 0.635 x 1.27: 1 -0.406,0; 2 0.406,0
SMA90_DIP = drill 1.5 pad 2.54: ANTENNA 0,0 | drill 1.6 pad 2.54: GND1 -2.54,2.54; GND2 2.54,2.54; GND3 -2.54,-2.54; GND4 2.54,-2.54
1X03 = drill 1.016: 1 -2.54,0; 2 0,0; 3 2.54,0
VALCON_CSP-USC16-TR = smd 0.3 x 1.14: A1 -3.35,0; A4 -2.55,0; A5 -1.25,0; A6 -0.25,0; A7 0.25,0; A8 1.25,0; A9 2.55,0; A12 3.35,0; B1 3.05,0; B4 2.25,0; B5 1.75,0; B6 0.75,0; B7 -0.75,0; B8 -1.75,0; B9 -2.25,0; B12 -3.05,0 | drill 0.65 pad 1 long: S1 -4.325,-0.59; S2 4.325,-0.59 | drill 0.65 pad 0.9 long: S3 -4.325,-4.77; S4 4.325,-4.77 | hole 0.65: -2.89,-1.07; 2.89,-1.07
MCSJK7U1200121080B10 = smd 1.4 x 1.2: 1 -1.1,-0.85; 2 1.1,-0.85; 3 1.1,0.85; 4 -1.1,0.85

### Placement (x,y rotation side)
3V3_LINK  77.25,29.94 270 top
ANALOG_EXPANDER  28,32 90 top
AP2112  61,56 180 top
AVRDB  42.75,45.25 180 top
C1  16.5,69.5 0 top
C2  16.5,56.5 0 top
C3  16.5,43 0 top
C4  16.5,29.5 0 top
C5  16.5,16 0 top
C6  16.5,4.5 0 top
C7  65.25,61.75 90 top
C8  65.25,66.25 90 top
C9  65.25,70.75 90 top
C10  74.5,13.75 180 top
C11  40.25,39 0 top
C12  33.75,47.5 270 top
C13  44.5,52.5 180 top
C14  77.12,54.81 180 top
C15  53.75,56.25 270 top
C16  44.75,34 180 top
C17  48,36.75 270 top
C18  40.25,36.5 0 top
C19  36.5,47.5 270 top
C20  44.5,50.25 180 top
C21  56.75,56.25 270 top
C22  41.25,29.5 180 top
C23  74.5,11.25 180 top
C24  72.5,54.25 180 top
C25  72.53,51.88 180 top
C26  41.25,32 180 top
C27  45.5,60 90 top
C28  32,63.5 180 top
CN1  82,31 90 top
CN2  82,20 90 top
CN3  82,75 90 top
CP2102  67.29,50.45 180 top
D1  20.5,67.5 270 top
D2  20.5,54.5 270 top
D3  20.25,41 270 top
D4  20,27.5 270 top
D5  20.5,14 270 top
D6  24.25,4.5 90 top
D7  54,61.75 180 top
D8  54,66 180 top
D9  54,70.75 180 top
D10  74.62,49.15 180 top
D11  74.61,46.57 0 top
FD1  1,3.5 0 top
FD2  84,3.5 0 top
FD3  83.5,84.5 0 top
GND_LINK  68,66.75 270 top
J1  0,80 0 top
J2  0,67 0 top
J3  0,54 0 top
J4  0,40 0 top
J5  0,27 0 top
J6  0,14 0 top
J7  58.6,36.21 90 top
JP1  63.93,21.4 0 top
JP5  61.4,24.73 180 top
JP6  61.4,27.27 180 top
LED  50.31,50.25 180 top
LOGO1  20.5,82 0 top
MCP1501  41,63.5 90 top
R1  6.68,72.36 0 top
R2  6.68,59.4 0 top
R3  6.68,46.2 0 top
R4  6.68,32.23 0 top
R5  6.68,19.27 0 top
R6  6.68,6.32 0 top
R7  20.5,72.5 0 top
R8  20.5,59.5 0 top
R9  20.5,46 0 top
R10  20.5,32.5 0 top
R11  20.5,19 0 top
R12  20.5,7.5 0 top
R13  62.25,61.75 270 top
R14  62.25,66.25 270 top
R15  62.25,70.75 270 top
R16  16.5,72.5 180 top
R17  16.5,59.5 180 top
R18  16.5,46 180 top
R19  16.5,32.5 180 top
R20  16.5,19 180 top
R21  16.5,7.5 180 top
R22  59.25,61.75 270 top
R23  59.25,66.25 90 top
R24  59.25,70.75 90 top
R25  20.5,69.5 0 top
R26  20.5,56.5 0 top
R27  20.5,43 180 top
R28  20.5,29.5 180 top
R29  20.5,16 180 top
R30  20.5,4.5 180 top
R31  56.25,61.75 90 top
R32  56.25,66.25 90 top
R33  56.25,70.75 90 top
R34  47.94,50.44 270 top
R35  38,30.75 90 top
R36  36,66.5 0 top
R37  36,60.5 0 top
R38  32,60.5 0 top
R39  67.5,35.25 180 top
R40  65.5,56.75 90 top
R41  74.5,16.75 0 top
R42  36,63.5 0 top
R43  71.5,35.25 0 top
RFM69  62,11 0 top
RJ45  79.5,63.5 90 top
S1  67.75,40.5 180 top
SL1  77.3,38.33 0 top
SL2  77.3,40.62 0 top
SL3  77.3,35.53 0 top
SL4  77.3,33.24 0 top
SMA  80.5,9 270 top
UART_3.3  74.25,19 180 top
UDPI  35.24,33.1 270 top
USB  78.2,48 90 top
USB_RX  62,51.75 180 top
USB_TX  62,49.25 180 top
XTAL  44.75,36.75 0 top

### Tracks (layer width: path | path; a pad name or v marks a point on that pad's centre or on a via)
3.3V  (via drill 0.4)
  Top 0.203: 59.7,55 AP2112.5 | AVRDB.42 42.55,41.05 41.91,40.41 41.01,40.41 | AVRDB.28 38.75,46.25 37.75,47.25 | C20.1 45.35,49.85 44.55,49.05 AVRDB.14
  Top 0.254: C11.1 39.4,39.82 39.99,40.41 41.01,40.41 | C19.1 37.4,48.35 37.75,48 37.75,47.25 | UART_3.3.1 75.35,18.31 R41.2
  Top 0.305: 68.75,41 v68.5,41.25
  Top 0.406: CN1.3 79.33,40.67 79.33,41.62 78.7,42.25 75,42.25 73.75,41 68.75,41 | R39.1 69.5,35.25 R43.1 | 75.26,11.34 C23.1 75.26,11.16 | 75.42,16.68 R41.2 | C11.1 C18.1 39.4,35.4 v39.25,35.25 39.25,33.5 38,32.25 R35.2
  Top 0.508: C19.1 C12.1 | C13.1 C20.1 | v34.25,55.5 34.75,56 v39,56 39.09,56.09 39.09,59.25 | 39.09,59.25 MCP1501.1 | 39.09,59.25 41.25,59.25 | 41.25,59.25 45.4,59.25 C27.1 47.78,59.15 48.09,59.46 48.09,62.16 47.75,62.5 47.75,74.75 55,82 CN3.3 | MCP1501.3 41.63,59.63 41.25,59.25
  Top 0.61: R15.2 v62.25,68.5 | v62.25,68.5 | R14.2 v62.25,64 | v62.25,64 | v20.5,26 20.5,21.35 21.35,20.5 R11.2 21.5,18.85 v21.5,17.5 | v62.25,59.5 | R13.2 v62.25,59.5 | R7.2 21.5,72.35 v21.5,71 | v21.5,66 21.5,59.65 R8.2 21.5,59.35 v21.5,58 | v21.5,53 v21.5,48.75 21.5,46.15 R9.2 21.5,45.85 v21.5,44.5 | v21.5,39.5 21.5,32.65 R10.2 21.5,32.35 v21.5,31 | v25.25,48.75 33.35,48.75 C12.1 v33.75,50 | v72.5,30.25 72.61,30.36 3V3_LINK.1 78.64,30.36 78.75,30.25 v78.75,23.25 78.75,18.47 76.95,16.68 75.42,16.68 | AP2112.5 57.1,55.05 C21.2 C15.2 53.75,54 53.25,53.5 | v62.25,53.5 53.25,53.5 | C13.1 45.75,52.9 v45.75,53.75 46,53.75 46.25,53.5 53.25,53.5 | v59.25,48 54.5,48 53.75,48.75 53.75,53 53.25,53.5 | v72.5,32.5 71,32.5 69.5,34 69.5,35.25 69.5,36.25 v68.5,37.25 | R41.2 C10.1 C23.1 75.35,10.35 72,7 RFM69.VDD | R35.2 36.28,31.6 UDPI.3 35.24,28.99 30.63,24.38 ANALOG_EXPANDER.2 | R12.2 21.5,7.65 v21.5,12.5 | v68.5,41.25 68.5,43 67.25,44.25 64,44.25 v63.5,44.75
  Bottom 0.406: 78.75,23.75 v78.75,23.25
  Bottom 0.508: v45.75,53.75 43.5,56 v39,56 | v34.25,55.5 34.25,50.5 v33.75,50
  Bottom 0.61: v62.25,64 v62.25,59.5 | v62.25,59.5 | v62.25,68.5 v62.25,64 | v62.25,64 | CN2.3 78.75,23.75 | v21.5,17.5 v21.5,12.5 | v21.5,71 v21.5,66 | v21.5,58 v21.5,53 | v21.5,44.5 v21.5,39.5 | v21.5,31 20.5,30 v20.5,26 20.5,24.5 21.25,23.75 27.37,23.75 ANALOG_EXPANDER.2 | v72.5,32.5 v72.5,30.25 | v62.25,59.5 v62.25,53.5 | v25.25,48.75 v21.5,48.75 | v68.5,41.25 v68.5,37.25 | 62.5,44.75 v63.5,44.75 | v59.25,48 62.5,44.75 | 62.5,44.75 59.52,41.77 59.08,41.77 J7.3
+5V  (via drill 0.4)
  Top 0.254: 69.79,52.46 CP2102.7 | CP2102.8 69.3,52.95
  Top 0.305: 69.3,52.95 69.62,52.62 | 69.62,52.62 69.79,52.46 | 71.65,55.9 C24.2 71.25,54.25 69.62,52.62 | USB.B9 78.05,45.6 USB.A4 | USB.A9 78.06,50.41 78.06,50.39 USB.B4
  Top 0.406: JP1.VCC 71.71,21.56 71.71,22.34 JP5.2 | RJ45.5 73.08,64.07
  Top 0.508: 73.08,64.07 72.72,64.13 71.16,62.87 RJ45.4 | v76.28,46.19 76.87,45.6 78.05,45.6 | v76.25,49.75 76.91,50.41 78.06,50.41
  Top 0.61: 76.26,55.9 71.65,55.9 R40.1 65,55.9 64.15,55.05 AP2112.1 | 76.26,55.9 76.26,54.83 C14.2 76.28,54.62 76.25,54.59 v76.25,49.75 | 76.26,55.9 76.26,57.61 76.28,57.63 v76.28,62.96
  Bottom 0.61: JP5.2 JP5.1 77.13,24.73 78.82,26.42 78.82,28.45 76.28,30.99 v76.28,46.19 76,46.47 76,49.5 v76.25,49.75 | RJ45.5 74.07,64.13 75.26,64.13 v76.28,62.96
_RESET  (via drill 0.4)
  Top 0.203: 47.81,20.83 47.17,20.83 44.25,23.75 44.25,27 42.1,29.15 C22.1
  Top 0.305: 47.81,20.83 v48.9,20.83
  Top 0.406: JP1.DTR JP5.6
  Bottom 0.305: v48.9,20.83 63.36,20.83 JP1.DTR
ANALOG_INPUT  (via drill 0.4)
  Top 0.203: AVRDB.37 40.5,42.25 38.5,42.25 v38,41.75 37.75,41.5 37,41.5 32.25,36.75
  Top 0.305: ANALOG_EXPANDER.4 29.96,29.46 32.25,31.75 32.25,36.75 | v40,52.75 40,54.75 42.75,57.5 48.25,57.5 49.75,59 49.75,71.25 57,78.5 CN3.2
  Bottom 0.254: v38,41.75 38.5,42.25 38.5,50 40,51.5 v40,52.75
AVR_RX  (via drill 0.4)
  Top 0.203: 54.22,35.29 54.22,41.78 53.5,42.5 v53.5,43.5 53.5,44 52.75,44.75 48.25,44.75 48.15,44.65 AVRDB.5 | USB_TX.2 61.59,49.66
  Top 0.254: JP5.4 67.77,25.98 67.77,27.94
  Top 0.305: 54.22,35.29 59.5,30 65.84,30 67.77,28.07 67.77,27.94 | 61.59,49.66 60.5,50.75 v55,50.75
  Top 0.406: JP1.TXO JP5.4
  Bottom 0.203: v55,50.75 53.5,49.25 v53.5,43.5
AVR_TX  (via drill 0.4)
  Top 0.203: 53.46,34.9 53.46,41.29 52.25,42.5 v52.25,43.5 51.5,44.25 AVRDB.4
  Top 0.254: JP5.5 65.21,26 65.21,28.04
  Top 0.305: 65.21,28.04 65.25,28.09 65.25,28.35 64.35,29.25 59.11,29.25 53.46,34.9 | USB_RX.2 61.09,52.25 v55,52.25
  Top 0.406: JP5.5 JP1.RXI
  Bottom 0.203: v55,52.25 54.25,52.25 52.25,50.25 v52.25,43.5
CT1
  Top 0.203: AVRDB.23 40.95,50.05 37.25,53.75 33.25,53.75 33,54 32.75,54
  Top 0.305: D1.K 22,67.5 22.75,66.75 22.75,58 26.75,54 32.75,54
  Top 0.61: 21.59,69.26 R25.2 21.35,67.6 D1.K
CT2
  Top 0.203: AVRDB.24 40.55,49.45 37,53 33,53
  Top 0.305: 33,53 25.85,53 22.35,56.5 R26.2 | D2.K 21.35,54.6
  Top 0.61: R26.2 21.5,56.35 21.5,54.75 D2.K
CT3
  Top 0.203: AVRDB.25 39.75,47.5 39.75,49.25 37,52 33,52
  Top 0.305: 33,52 25.5,52 23,49.5 23,43.5 22.5,43 R27.1
  Top 0.61: 21.59,42.76 R27.1 21.35,41.35 D3.K
CT4
  Top 0.203: AVRDB.26 39.2,47.05 39,47.25 39,49 37,51 33,51
  Top 0.254: 24,49 26,51
  Top 0.305: 24,49 24,30.71 22.79,29.5 R28.1 | 26,51 33,51
  Top 0.61: 21.59,29.26 R28.1 21.5,29.35 21.5,28.25 D4.K
CT5
  Top 0.203: 25.25,42.5 25.25,43.5 27.5,45.75 31.5,45.75 31.8,45.45 AVRDB.30
  Top 0.254: 21.75,16 25,19.25
  Top 0.305: 21.5,15.85 R29.1 21.75,16 | 25,19.25 25.25,19.5 25.25,24 25.5,24.25 25.5,27.75 25.25,28 25.25,42.5
  Top 0.61: R29.1 21.59,15.76 | 21.5,15.85 21.5,14.25 D5.K
CT6
  Top 0.203: AVRDB.31 36.05,45.05 36,45 28,45 26.25,43.25 26.25,42.5
  Top 0.305: D6.K 23.5,9.5 26.25,12.25 26.25,42.5
  Top 0.61: 21.55,4.3 R30.1 D6.K
CT7
  Top 0.203: AVRDB.32 36.4,44.65 36.25,44.5 32.34,44.5 30,42.16 ANALOG_EXPANDER.9
CT8
  Top 0.203: AVRDB.33 36.8,44.25 36.55,44 33.38,44 29,39.62 ANALOG_EXPANDER.8
CT9
  Top 0.203: AVRDB.34 37.1,43.85 36.75,43.5 34.5,43.5 28.08,37.08 ANALOG_EXPANDER.7
CT10
  Top 0.203: AVRDB.35 37.55,43.45 36.8,42.7 35.2,42.7 30.25,37.75
  Top 0.305: ANALOG_EXPANDER.6 29.54,34.54 30.25,35.25 30.25,37.75
CT11
  Top 0.203: AVRDB.36 37.8,43.05 36.75,42 36.02,42 31.25,37.23
  Top 0.305: ANALOG_EXPANDER.5 30.5,32 31.25,32.75 31.25,37.23
D+  (via drill 0.4)
  Top 0.203: USB.B6 77.25,48.75 v77,49
  Top 0.254: CP2102.4 71.05,50.45 74.18,47.32 D11.K 74.79,47.5 v77,47.5 77.25,47.75 USB.A6
  Bottom 0.203: v77,47.5 v77,49
D-
  Top 0.203: USB.A7 79.25,48.25 79.5,48 79.5,47.5 79.25,47.25 USB.B7
  Top 0.254: USB.A7 74.77,48.25 D10.K 74.1,48.4 71.55,50.95 CP2102.5
DIG1
  Top 0.406: RFM69.ANT 72.13,5
  Top 1.016: 72.13,5 arc45 73.93,5.74 76.44,8.26 arc-45 78.24,9 SMA.ANTENNA
DS18B20  (via drill 0.4)
  Top 0.203: 62.25,32.5 61.5,33.25 61.5,38 60.5,39 v60.5,40.5 60.5,45 59.5,46 55.5,46 55.25,46.25 47.5,46.25 47.1,45.85 AVRDB.8 | 72.92,38.83 72,39.75 66.5,39.75 66.25,40 v63.75,40
  Top 0.254: 62.25,32.5 65.5,32.5 v65.75,32.75 | R43.2 73.25,36.15 73.25,37.25 | 72.92,38.83 73.25,38.5 73.25,37.25 | 73.25,37.25 76.89,37.25
  Top 0.305: SL1.1 76.89,37.25 SL3.1 76.78,35.53
  Bottom 0.203: v63.75,40 63.25,40.5 v60.5,40.5
  Bottom 0.254: v65.75,32.75 63.94,30.94 JP6.6
DTR  (via drill 0.4)
  Top 0.203: 68.75,46 68,45.25 64.5,45.25 62,47.75 61,47.75 59.5,49.25 v55,49.25 55.25,49.25 | v54.75,43.5 55,43.25 55,36.5 v55.25,36.25 | C26.1 44,32 45,31 47,31 v49.25,33.25
  Top 0.254: CP2102.28 68.79,46.04
  Top 0.305: 68.75,46 68.79,46.04
  Bottom 0.203: v55.25,36.25 53.75,34.75 50.75,34.75 v49.25,33.25 | v55,49.25 54.75,49 v54.75,43.5
GND  (via drill 0.4)
  Top 0.203: 58.5,56 57.4,57.1 C21.1 C15.1 | 37.65,46.5 38.3,45.85 AVRDB.29 | AVRDB.43 42.95,40.7 | AVRDB.15 44.15,48.86 44.07,48.95
  Top 0.254: 43.72,50.25 C20.2 | C13.2 C20.2 | 37.65,46.5 36.65,46.5 C19.2 36.35,46.5 33.9,46.5 C12.2 | C20.2 43.65,49.36 44.07,48.95 | 42.95,40.7 41.25,39 C11.2 | CP2102.3 70.8,49.95 71.25,49.5
  Top 0.305: C16.1 45.6,35.65 XTAL.2 C17.2 | R38.1 C28.2 31.15,65 v31.25,65 | 35.13,66.52 R36.1 34,66.5 33.93,66.57 v33.87,66.57 | 41.67,66.23 MCP1501.6 | RJ45.8 68.78,67.94 GND_LINK.1 | C25.1 74.12,51.88 v74.5,51.5 74.62,51.38 D10.A | 71.25,49.5 v71.25,48.75 70.25,47.75 69.99,47.75 CP2102.M | CP2102.EXP v67,50.74 v67,50.75 | AVRDB.49 41.75,44.25 v41.75,44 | RFM69.GND1 v53,5
  Top 0.406: C16.1 45.6,33.27 v46.08,32.79 | C17.2 48,34.69 v48.12,34.57 | v54,63.75 D7.A | v54,68 D8.A | v54,73 D9.A | R24.1 v59.25,68.5 | R23.1 v59.25,64 | R22.2 v59.25,59.5 | MCP1501.6 MCP1501.5 | MCP1501.5 43.91,66.2 v44.03,66.32 | MCP1501.2 40.37,61.64 40.98,62.25 42.25,62.25 42.91,61.6 MCP1501.4 | MCP1501.4 42.95,60.85 C27.2 46.69,60.85 v46.82,60.98 | MCP1501.5 MCP1501.4 | 73.74,11.22 73.74,10.41 72.33,9 RFM69.GND | 73.74,11.34 73.74,13.66 C10.2 73.75,13.85 v73.75,15.25
  Top 0.508: AP2112.2 58.5,56 | 73.74,11.34 C23.2 73.68,11.22 73.74,11.22
  Top 0.61: J1.1 2.37,73.27 v2.37,71.09 | J2.1 2.37,60.27 v2.37,58.13 | J3.1 2.37,47.27 v2.37,44.93 | J4.1 2.37,33.27 v2.37,30.96 | J5.1 2.37,20.27 v2.37,18 | J6.1 2.37,7.27 v2.37,5.05 | R21.2 15.83,7.68 v15.83,9.11 15.83,11.62 J6.4 | 15.19,23.73 15.7,24.24 J5.4 15.5,24.55 v15.5,22 15.5,19.15 R20.2 15.75,19.1 | R19.2 16,32.85 v16,35.5 16,37.45 J4.4 15.7,37.24 15.19,36.73 | 15.19,50.73 15.7,51.24 J3.4 15.83,51.62 v15.83,48.74 16,48.56 16,48 15.65,47.65 R18.2 | 16.34,64.11 J2.4 15.83,64.62 v15.83,61.94 15.83,59.68 R17.2 | C14.1 79.2,53.58 79.2,52.73 USB.S2 | R16.2 15.83,72.68 v15.83,75.15 15.83,77.62 J1.4 | C12.2 33.6,46.5 v32.25,46.5 | C11.2 C18.2 41.1,34.85 v41,34.75 | C13.2 43.65,53.4 v44,53.75 | USB.S2 USB.S4 | USB.A1 78.2,44.27 USB.S1 USB.S3 | USB.A12 78.2,51.73 USB.S2
  Top 1.016: J1.1 4.32,73.3 R1.1 | J2.1 4.37,60.3 R2.1 | J3.1 4.16,47.3 R3.1 | J4.1 4.19,33.3 R4.1 | J5.1 4.23,20.3 R5.1 | J6.1 4.28,7.3 R6.1
  other vias: 18.25,41 18.5,54.5 48.58,39.91 31.13,57.67 57.89,74.6 31.58,5.05 41.75,46.5 44,46.5 44,44 52.25,52 44.08,29.8 56.83,34.8 74.33,34.8 74.58,38.55 64.58,36.05 69.83,54.55 67.08,61.55 23.83,52.8 28.83,50.05 22.83,36.8 23.08,22.05 23.83,28.55 18.08,27.55 23.83,14.8 29.58,43.8 26.08,46.8 40.88,57.67 35.88,57.67 50,74.25 61.39,80.1 75.89,80.35 75.89,76.35 71.39,76.6 45.75,74.5 53.83,59.05 56.83,59.05 63.83,56.3 52.08,55.05 72.08,18.3 52.08,14.3 56.08,29.55 43.58,5.05 34.58,24.05 41.58,24.05 28.58,15.05 48.58,15.05 55.08,19.55 80.58,15.55 18.08,14.05 26.58,4.55 18.58,67.55 76.08,84.05 61.08,84.05 10.58,84.05 26.08,57.55 25.08,65.05 44.58,39.41 72.25,15.25
  pour Bottom: -1.25,89 -1.25,-1 86.5,-1 86.5,89
  pour Top: -2.02,89 86,89 86,-1 -2.02,-1
LCD_BUTTON  (via drill 0.4)
  Top 0.254: R39.2 69,32.9 69,32.75
  Top 0.305: S1.3 66.25,38.25 | 66.25,38.25 S1.1 | R39.2 66.65,37.85 66.25,38.25 | v69,32.5 | 69,32.75 v69,32.5
  Bottom 0.254: JP6.4 69.02,32.48 v69,32.5
LED
  Top 0.203: AVRDB.12 45.95,47.45 47.5,49 47.5,49.15 R34.2
N$1
  Top 0.61: C1.1 13.82,69.5 11.8,71.52 J1.2
  Top 1.016: R1.2 9.05,73.3 J1.2
N$2
  Top 0.61: R31.2 R22.1 R13.1 C7.2
N$3
  Top 0.61: C3.1 14,43 11.8,45.2 J3.2
  Top 1.016: R3.2 9.21,47.3 J3.2
N$4
  Top 0.61: R32.2 R23.2 R14.1 C8.2
N$5
  Top 0.61: C4.1 14.1,29.5 11.8,31.8 J4.2
  Top 1.016: R4.2 9.18,33.3 J4.2
N$12
  Top 0.61: R33.2 R24.2 R15.1 C9.2
N$13
  Top 0.61: C2.1 13,56.5 11.8,57.7 J2.2
  Top 1.016: J2.2 9,60.3 R2.2
N$14
  Top 0.61: C5.1 14,16 11.8,18.2 J5.2
  Top 1.016: R5.2 9.13,20.3 J5.2
N$15
  Top 0.61: R20.1 C5.2 R29.2 R11.1 R20.1
N$16
  Top 0.61: R8.1 R17.1 C2.2 R26.1 | R26.1 | 19.65,59 R26.1 | R26.1
N$17
  Top 0.61: R10.1 R28.2 C4.2 R19.1 R10.1 | R10.1
N$18
  Top 0.61: R25.1 R7.1 R16.1 C1.2 R25.1 | R25.1
N$19
  Top 0.61: J6.2 14.6,4.5 C6.1
  Top 1.016: J6.2 9.09,7.3 R6.2
N$20
  Top 0.61: R12.1 R21.1 C6.2 R30.2 R12.1
N$21
  Top 0.61: R27.2 C3.2 R18.1 R9.1 R27.2
N$22
  Top 0.305: SL2.2 SL1.2 79.07,38.33 79.84,37.56 79.84,35.78 81.12,34.5 CN1.2
N$23
  Top 0.305: SL3.2 SL4.2 79.33,33.24 80.09,32.48 80.09,25.41 CN2.2
N$24
  Top 0.61: GND_LINK.2 68.84,65.5 70.52,65.5 RJ45.6
N$25
  Top 0.406: R40.2 65.35,57.45
  Top 0.508: 65.35,57.45 62.75,57.45 AP2112.3
N$26
  Top 0.305: R37.2 36.85,61.56 36.41,62 35.9,62 35.15,62.75 R42.1 C28.1
N$27
  Top 0.305: R42.2 R36.2 37.75,66.5 38.05,66.2 MCP1501.8 MCP1501.7
N$28
  Top 0.61: 3V3_LINK.2 77.25,27.88 JP6.1
N$29
  Top 0.254: 69.17,8.35 69.17,9.62
N$30
  Top 0.2: 62.25,49.25 61.75,49.25
N$31
  Top 0.254: CP2102.6 71.2,51.45 71.25,51.5 71.75,51.5 71.9,51.65 C25.2
N$32
  Top 0.2: 62.25,51.75 61.75,51.75
N$33
  Top 0.254: JP1.CTS 73.84,21.15 UART_3.3.2
N$41
  Top 0.203: LED.A 47.95,51.3 R34.1
PULSE1  (via drill 0.4)
  Top 0.203: 63.01,33.24 62.25,34 62.25,38.25 61.5,39 61.5,45 59.99,46.51 55.74,46.51 55.5,46.75 47.25,46.75 46.75,46.25 AVRDB.9
  Top 0.254: 63.01,33.24 64.24,33.24 v64.5,33.5 64.75,33.75 66.15,33.75 68.4,31.5
  Top 0.305: SL4.1 76.13,33.24 74.39,31.5 68.4,31.5
  Bottom 0.254: v64.5,33.5 64.5,33.25 61.4,30.15 JP6.7
PULSE2  (via drill 0.4)
  Top 0.203: 62.25,41.25 62.25,45.25 60.5,47 56,47 55.75,47.25 47,47.25 46.4,46.65 AVRDB.10 | 62.25,41.25 62.25,39.25 63,38.5 63,35 63.25,34.75 v63.25,34.25 | 75.69,40.94 74.94,40.94 74.25,40.25 67.5,40.25 66.5,41.25 62.25,41.25
  Top 0.254: 76.13,40.94 75.69,40.94
  Top 0.305: SL2.1 76.56,40.94 76.13,40.94
  Bottom 0.254: JP6.8 58.86,29.11 63.25,33.5 v63.25,34.25
RESET  (via drill 0.4)
  Top 0.203: AVRDB.40 41.75,41.75 41.5,41.5 39.25,41.5 37.5,39.75 37.5,34.5 v37.25,34.25 | R35.1 38.4,29.5 39.75,29.5 | 39.75,29.5 C22.2 | 39.75,29.5 40.4,30.15 C26.2 40.25,32.15 v40.25,33.25
  Bottom 0.203: v37.25,34.25 38.25,33.25 v40.25,33.25
RFM_IRQ
  Top 0.305: JP5.11 51.24,23.48 51.91,22.81 51.91,16.21 53.12,15 RFM69.IRQ
RFM_MISO
  Top 0.203: 53,22.9 52.53,23.37 52.53,25.98 JP6.11 53,29.03 53,31.26 51,33.26 51,40.75 49,42.75 46.5,42.75 46.2,43.05 AVRDB.1
  Top 0.305: 53,22.9 53,17.5 53.5,17 RFM69.SDO
RFM_MOSI  (via drill 0.4)
  Top 0.203: JP6.10 55.07,25.98 55.07,22.35 | AVRDB.48 48.5,42.3 50.25,40.55 50.25,32.75 51.75,31.25 v51.75,29.5
  Top 0.305: 55.07,22.35 57.74,19.68 60.15,19.68 61.8,18.03 67.64,18.03 68.41,17.27 68.41,14.71 70.12,13 RFM69.SDI | JP6.10 53.78,27.77 54.25,28.24 v54.25,29.5
  Bottom 0.305: v54.25,29.5 v51.75,29.5
RFM_RESET
  Top 0.305: JP5.12 48.7,22.8 50.75,20.75 50.75,9 52.75,7 RFM69.RST
RFM_SCK  (via drill 0.4)
  Top 0.203: JP6.12 49.99,25.98 49.99,22.99 | 51.75,33.75 51.75,41 49.5,43.25 46.75,43.25 46.55,43.45 AVRDB.2
  Top 0.305: 49.99,22.99 50.63,22.35 v50.63,22.23 | v56.59,22.23 58.88,22.23 62.31,18.8 68.15,18.8 69.17,17.78 69.17,15.5 69.67,15 RFM69.SCK | v54.25,31.25 51.75,33.75 | v49.75,29.5 48.75,28.5 48.75,27.32 JP6.12
  Bottom 0.305: v50.63,22.23 v56.59,22.23 | v54.25,31.25 51.5,31.25 v49.75,29.5
RFM_SEL
  Top 0.203: 52.5,34.5 52.5,41.25 50,43.75 47,43.75 46.9,43.85 AVRDB.3
  Top 0.254: 57.59,26 57.59,29.41
  Top 0.305: 58.86,23.52 58.88,23.5 | 58.88,23.5 62.82,19.56 68.67,19.56 70.5,17.73 RFM69.SEL 73.4,17 | 58.88,23.5 58.88,24.71 JP5.8 57.59,26 | 52.5,34.5 57.59,29.41
  Top 0.406: R41.1 73.4,17
SCL  (via drill 0.4)
  Top 0.203: v60,34 60.5,34.5 60.5,37.75 59.5,38.75 J7.2 57.5,38.75 56.75,39.5 56.75,44 55,45.75 47.75,45.75 47.45,45.45 AVRDB.7
  Top 0.254: 60.25,30.75 66.25,30.75 67.75,29.25 69.89,29.25 71.56,27.58
  Top 0.305: 71.56,27.58 JP6.3 | v58.5,32.5 60.25,30.75
  Bottom 0.203: v58.5,32.5 v60,34
SDA
  Top 0.203: AVRDB.6 47.8,45.05 48,45.25 54.5,45.25 56,43.75 56,38.5 58.29,36.21 J7.1 58.6,33.84 58.75,33.69
  Top 0.254: 58.75,33.69 60.75,31.69 66.31,31.69 68,30 70.25,30 71.25,29 73.25,29 74.1,28.15 JP6.2
UDPI
  Top 0.203: AVRDB.41 42.15,41.4 41.75,41 39.59,41 38.25,39.66 38.25,34 37.35,33.1 UDPI.2
USB_RXD
  Top 0.254: CP2102.25 67.29,47.04 | 65,46.75 63.75,48 63.75,51.25 63.25,51.75 USB_RX.1
  Top 0.305: 67.29,47.04 67,46.75 65,46.75
USB_TXD
  Top 0.254: CP2102.26 67.79,46.54 | 64.75,46 63,47.75 63,49.25 USB_TX.1
  Top 0.305: 67.79,46.54 67.25,46 64.75,46 | USB_TX.1 62.27,49.25
VREFA  (via drill 0.4)
  Top 0.203: AVRDB.27 39.1,46.65 38.25,47.5 38.25,48.75 36.95,50.05 v36.43,50.05
  Top 0.305: 34.86,60.5 R37.1 R38.2 32.85,55.4 33.75,54.5 37.59,54.5 37.93,54.16 v38.18,54.16 | ANALOG_EXPANDER.3 30.42,26.92 33.25,29.75 33.25,36.5 v36.5,39.75
  Bottom 0.305: v38.18,54.16 38.18,51.8 v36.43,50.05 36.5,49.98 v36.5,39.75
VS1
  Top 0.406: C7.1 68.27,57.88 72.3,57.88 RJ45.1
VS2
  Top 0.406: RJ45.2 69.61,60.33 68.61,61.33 68.61,62.54 65.75,65.4 C8.1
VS3
  Top 0.406: C9.1 65.33,69.82 73.49,69.82 75.01,68.29 75.01,62.2 74.31,61.59 RJ45.3
VSENS1
  Top 0.203: AVRDB.20 42.15,48.95 42.5,49.3
  Top 0.305: D7.K 53,61 52.25,60.25 52.25,57 50.5,55.25 43.71,55.25 42.5,54.04 42.5,49.3
  Top 0.61: D7.K 56.15,61 R31.1
VSENS2
  Top 0.203: AVRDB.21 41.75,51.25
  Top 0.305: D8.K 53,65.25 51.5,63.75 51.5,57.75 49.75,56 43.5,56 41.75,54.25 41.75,51.25
  Top 0.61: D8.K 56.1,65.25 R32.1
VSENS3
  Top 0.203: AVRDB.22 41.35,50.4 41,50.75
  Top 0.305: D9.K | D9.K 54,69.75 | 41,50.75 41,54.5 43.25,56.75 49,56.75 50.75,58.5 50.75,66.75 D9.K
  Top 0.61: 54,69.75 56.1,69.75 R33.1
XTAL1
  Top 0.203: 42.53,38.89 42.53,39 43.5,39.97 43.5,41.5 43.35,41.65 AVRDB.44
  Top 0.305: 42.53,38.89 42.53,36.1 42.78,35.84 43.59,35.84 XTAL.1 43.65,34.25 C16.2
XTAL2
  Top 0.203: C17.1 XTAL.3 45.85,38.75 45.85,38.9 45.85,39.65 43.75,41.75 AVRDB.45

### Text on the board
tPlace: CT1 | emonPi2 | 3.3V | OpenEnergyMonitor.org | Designed by Glyn Hudson & Trystan Lea | ANALOG | v2.0.1 | GND | VOLTAGE SENSOR | CT2 | GND / LINK | CT3 | USB PWR | CT4 | P2 | GND | TMP | TMP | P1 | 3.3V / EXT | CT5 | 3.3V | UART | RX | TX | 5V | GND | CT6 | Designed in | North Wales | Assembled in UK | Lead free PCB / RoHS components
_tsilk: Designed in | North Wales | Made in UK
_bsilk: 165mm ant | 433Mhz | 165mm ant | 165mm ant | 433Mhz | 433Mhz | 868Mhz | 82mm ant | 82mm ant | 82mm ant | 868Mhz | 868Mhz | 78mm ant | 915Mhz | 78mm ant | 915Mhz | 78mm ant | 915Mhz | 165mm ant | 433Mhz | 82mm ant | 868Mhz | 78mm ant | 915Mhz